# EAGLE schematic p1-001 (EAGLE 9.6.2)
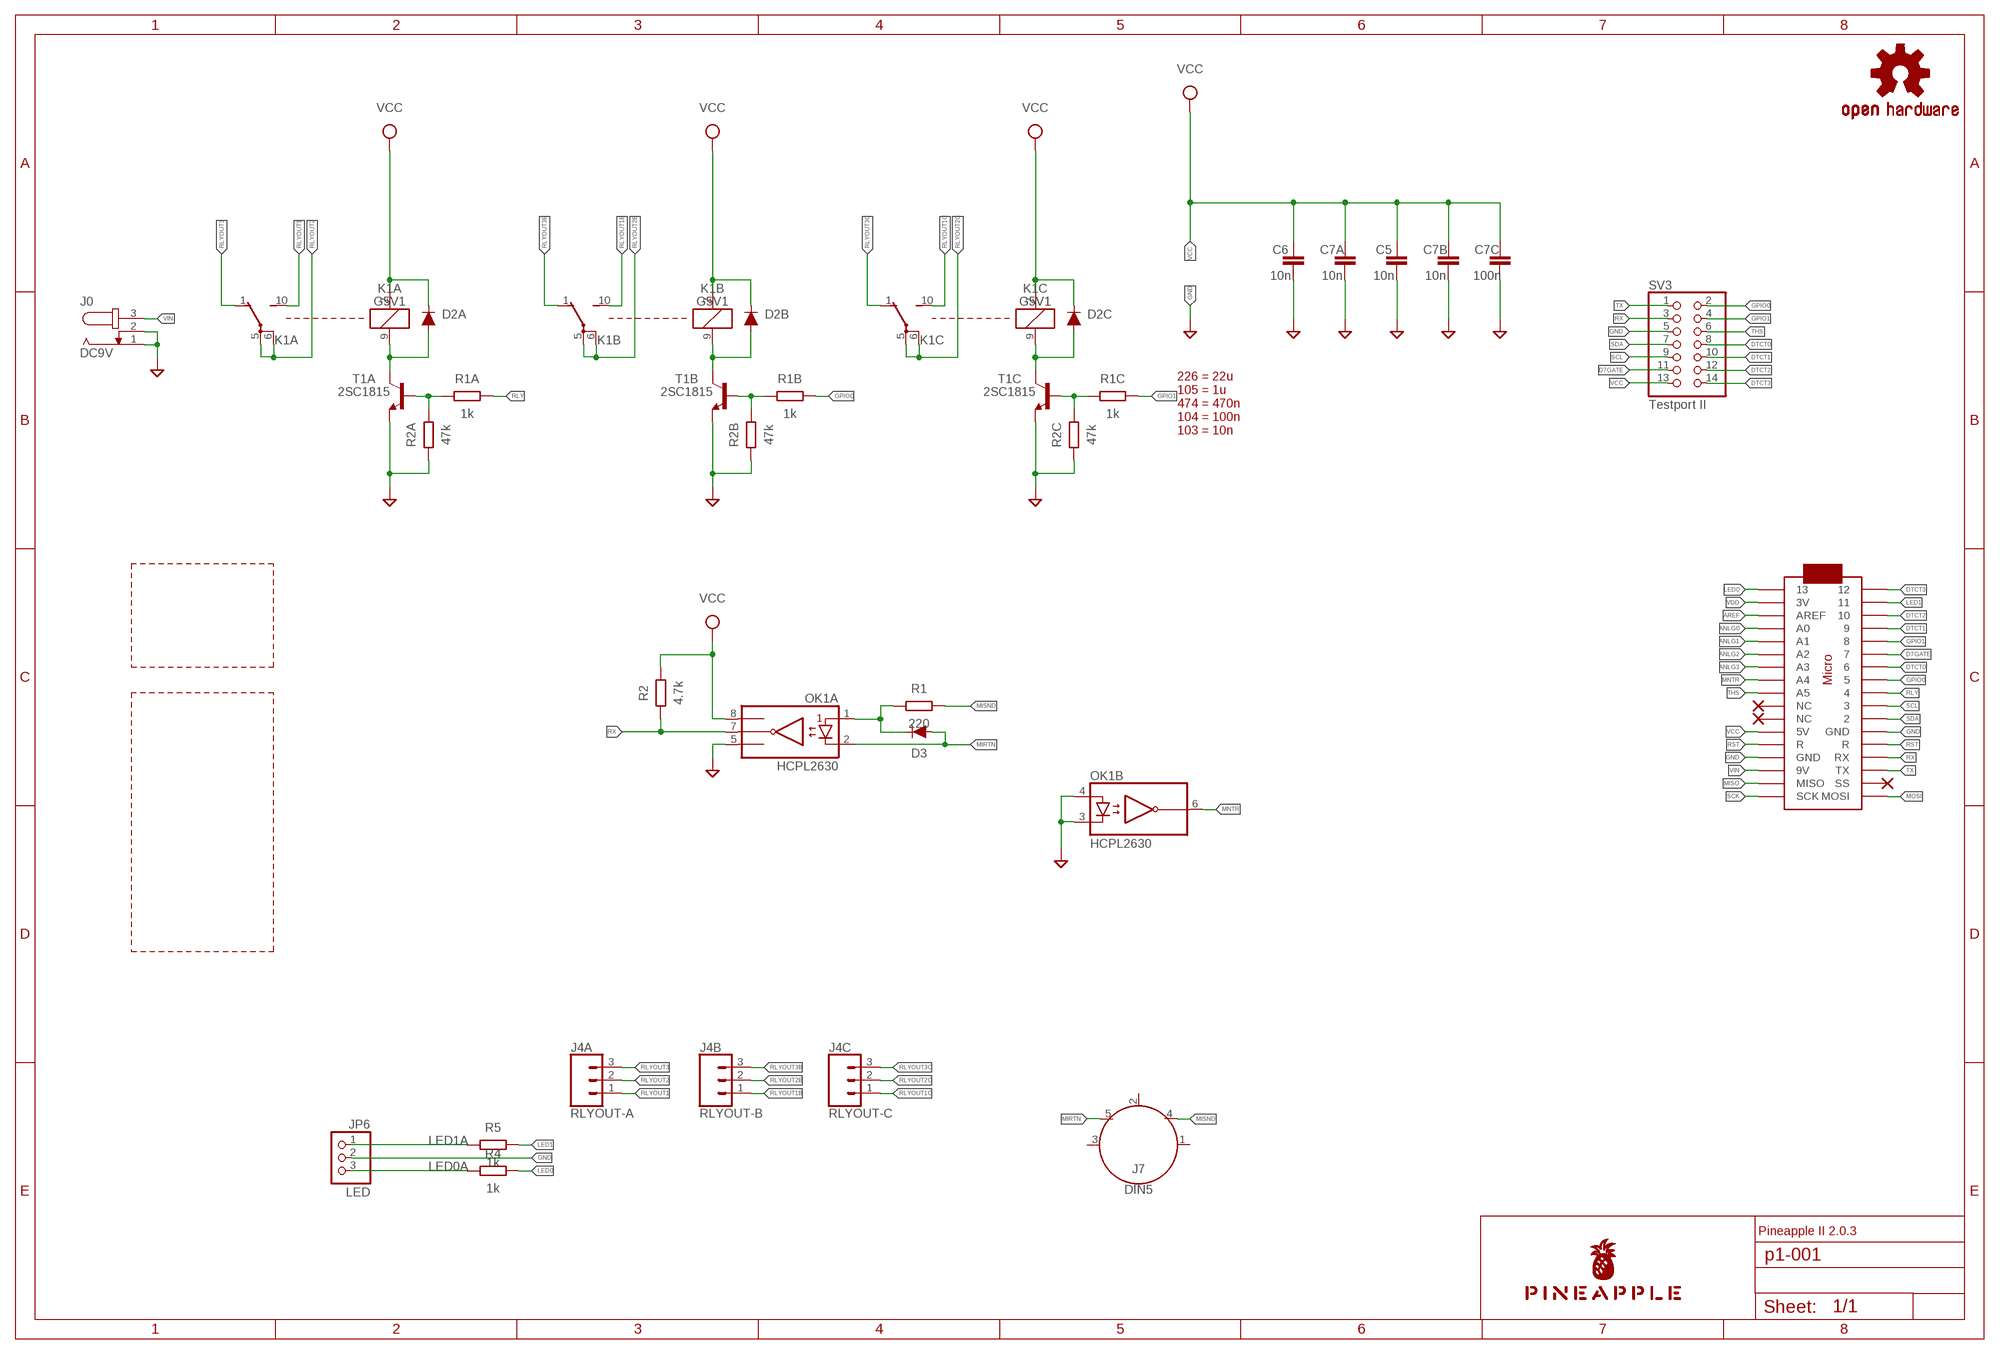
[diagram p0: schematic, sheet 1]

## Parts
C5  10n  C-EU025-024X044  [C025-024X044]
C6  10n  C-EU025-024X044  [C025-024X044]
C7A  10n  C-EU025-024X044  [C025-024X044]
C7B  10n  C-EU025-024X044  [C025-024X044]
C7C  100n  C-EU025-024X044  [C025-024X044]
D2A  DIODE-1N4148  [DIODE-1N4148]
D2B  DIODE-1N4148  [DIODE-1N4148]
D2C  DIODE-1N4148  [DIODE-1N4148]
D3  DIODE-1N4148  [DIODE-1N4148]
J0  DC9V  JACK-PLUG0  [SPC4077]
J4A  RLYOUT-A  CONN_03JST-PTH  [JST-3-PTH]
J4B  RLYOUT-B  CONN_03JST-PTH  [JST-3-PTH]
J4C  RLYOUT-C  CONN_03JST-PTH  [JST-3-PTH]
J7  DIN5  [DIN5-RA-PTH]
JP6  LED  PINHD-1X3  [1X03]
K1A  G5V1  [G5V1]
K1B  G5V1  [G5V1]
K1C  G5V1  [G5V1]
LOGO1  OSHW-LOGOS-COPPER  [OSHW-LOGO-S_COPPER]
MC1  ARDUINOMICRO  [ARDUINOMICRO]
OK1  HCPL2630  [DIL08]
R1  220  R-EU_0204/5  [0204/5]
R1A  1k  R-EU_0204/5  [0204/5]
R1B  1k  R-EU_0204/5  [0204/5]
R1C  1k  R-EU_0204/5  [0204/5]
R2  4.7k  R-EU_0204/5  [0204/5]
R2A  47k  R-EU_0204/5  [0204/5]
R2B  47k  R-EU_0204/5  [0204/5]
R2C  47k  R-EU_0204/5  [0204/5]
R4  1k  R-EU_0204/5  [0204/5]
R5  1k  R-EU_0204/5  [0204/5]
SV3  Testport II  PINHD-2X7  [2X07]
T1A  2SC1815  [TO92-ECB]
T1B  2SC1815  [TO92-ECB]
T1C  2SC1815  [TO92-ECB]
U$1  PINEAPPLE450_SILK  [PINEAPPLE450_SILK]

## Nets
ANLG0 [analog]: MC1.P$31(A0)
ANLG1 [analog]: MC1.P$30(A1)
ANLG2 [analog]: MC1.P$29(A2)
ANLG3 [analog]: MC1.P$28(A3)
AREF: MC1.P$32(AREF)
D7GATE: MC1.P$6 SV3.11
DTCT0: MC1.P$7 SV3.8
DTCT1: MC1.P$4 SV3.10
DTCT2: MC1.P$3 SV3.12
DTCT3: MC1.P$1 SV3.14
GND [gnd]: C5.2 C6.2 C7A.2 C7B.2 C7C.2 J0.1 J0.2 JP6.2 MC1.P$12(GND) MC1.P$21(GND) OK1.3(B:C2) OK1.4(B:A2) OK1.5(A:GND) R2A.1 R2B.1 R2C.1 SV3.5 T1A.E T1B.E T1C.E
GPIO0: MC1.P$8 R1B.2 SV3.2
GPIO1: MC1.P$5 R1C.2 SV3.4
LED0: MC1.P$34 R4.2
LED0A: JP6.3 R4.1
LED1: MC1.P$2 R5.2
LED1A: JP6.1 R5.1
MIDIINSND: D3.C OK1.1(A:A1) R1.1
MIRTN: D3.A J7.5 OK1.2(A:C1)
MISND: J7.4 R1.2
MISO: MC1.P$19(MISO)
MNTR: MC1.P$27(A4) OK1.6(B:VO2)
MOSI: MC1.P$17(MOSI)
RLY: MC1.P$9 R1A.2
RLYDRV: R1A.1 R2A.2 T1A.B
RLYDRV1: R1B.1 R2B.2 T1B.B
RLYDRV2: R1C.1 R2C.2 T1C.B
RLYOUT1: J4A.1 K1A.10(2:S)
RLYOUT1B: J4B.1 K1B.10(2:S)
RLYOUT1C: J4C.1 K1C.10(2:S)
RLYOUT2: J4A.2 K1A.5(2:P) K1A.6(2:P)
RLYOUT2B: J4B.2 K1B.5(2:P) K1B.6(2:P)
RLYOUT2C: J4C.2 K1C.5(2:P) K1C.6(2:P)
RLYOUT3: J4A.3 K1A.1(2:O)
RLYOUT3B: J4B.3 K1B.1(2:O)
RLYOUT3C: J4C.3 K1C.1(2:O)
RLYSNK: D2A.A K1A.9 T1A.C
RLYSNK1: D2B.A K1B.9 T1B.C
RLYSNK2: D2C.A K1C.9 T1C.C
RST: MC1.P$13(R) MC1.P$22(R)
RX: MC1.P$14(RX) OK1.7(A:VO1) R2.1 SV3.3
SCK: MC1.P$18(SCK)
SCL: MC1.P$10 SV3.9
SDA: MC1.P$11 SV3.7
THS: MC1.P$26(A5) SV3.6
TX: MC1.P$15(TX) SV3.1
VCC [power]: C5.1 C6.1 C7A.1 C7B.1 C7C.1 D2A.C D2B.C D2C.C K1A.2 K1B.2 K1C.2 MC1.P$23(5V) OK1.8(A:VCC) R2.2 SV3.13
VDD [power]: MC1.P$33(3V)
VIN [superpower]: J0.3 MC1.P$20(9V)
Unconnected: J7.1 J7.2 J7.3 MC1.P$16(SS) MC1.P$24(NC) MC1.P$25(NC)

## Notes on the sheet
- 226 = 22u
  105 = 1u
  474 = 470n
  104 = 100n
  103 = 10n
- Pineapple II 2.0.3

## Library data of the parts
C5 C6 C7A C7B C7C = resistor:C-EU: CAPACITOR, European symbol
D2A D2B D2C D3 = SparkFun-DiscreteSemi:DIODE: Diode These are standard reverse protection diodes and small signal diodes. SparkFun Products: SparkFun SparkPunk Sound Kit <https://www.sparkfun.com/products/11177> SparkFun ESP8266 Thing <https://www.sparkfun.com/products/13231>; PROD_ID: DIO-08378; VALUE: 200mA/100V/1V
J0 = con-jack:JACK-PLUG: DC POWER JACK Power Jack, DC, Right Angle, Through Hole, Rated 5A at 16VDC, PC Terminals Distributor: Farnell (www.Farnell.de) Drawing: 84N1161.pdf / 84N1162.pdf Manufacturer: SPC Technology (www.spctechnology.com) Type: SPC4077 / SPC 4078; OC_FARNELL: unknown; OC_NEWARK: unknown
J4A J4B J4C = SparkFun-Connectors:CONN_03: Multi connection point. Often used as Generic Header-pin footprint for 0.1 inch spaced/style header connections On any of the 0.1 inch spaced packages, you can populate with these: Break Away Headers - Straight <https://www.sparkfun.com/products/116> (PRT-00116) Break Away Male Headers - Right Angle <https://www.sparkfun.com/products/553> (PRT-00553) Female Headers <https://www.sparkfun.com/products/115> (PRT-00115) Break Away Headers - Machine Pin <https://www.sparkfun.com/products/117> (PRT-00117) Break Away Female Headers - Swiss Machine Pin <https://www.sparkfun.com/products/743> (PRT-00743) Stackable Header - 3 Pin (Female, 0.1") <https://www.sparkfun.com/products/13875> (PRT-13875) For SCREWTERMINALS and SPRING TERMINALS visit here: Screw Terimnals on SparkFun.com <https://www.sparkfun.com/search/results?term=Screw+Terminals> (5mm/3.5mm/2.54mm spacing) This device is also useful as a general connection point to wire up your design to another part of your project. Our various solder wires solder well into these plated through hole pads. Hook-Up Wire - Assortment (Stranded, 22 AWG) <https://www.sparkfun.com/products/11375> (PRT-11375) Hook-Up Wire - Assortment (Solid Core, 22 AWG) <https://www.sparkfun.com/products/11367> (PRT-11367) View the entire wire category on our website here <https://www.sparkfun.com/categories/141> Special notes: Molex polarized connector foot print use with SKU : PRT-08232 with associated crimp pins and housings.; PROD_ID: WIRE-10037; SF_ID: PRT-09915
J7 = SparkFun-Connectors:DIN5: DIN5 Connector - Female Right Angle (frequently used as a MIDI Jack connector) This type of connector and cable is frequently used for transmitting midi data (musical instrument digital interface). It is what you usually see on a keyboard or set of electronic drums. Learn more here <https://en.wikipedia.org/wiki/MIDI>. For more information on the pinout and electrical specifications of MIDI communications, please see the following resource: https://www.midi.org/specifications/item/midi-din-electrical-specification Here is the connector we sell at SparkFun: MIDI Connector - Female Right Angle <https://www.sparkfun.com/products/9536> (PRT-09536) Datasheet <hhttp://www.sparkfun.com/datasheets/Prototyping/Connectors/MIDI-RA.pdf> It is used on this SparkFun product: SparkFun MIDI Shield <https://www.sparkfun.com/products/12898> (DEV-12898); PROD_ID: CONN-09481
JP6 = pinhead:PINHD-1X3: PIN HEADER
K1A K1B K1C = relay:G5V1: RELAY 1 x switch, 0.5 A/125 V AC, 1 A/24 V DC , Omron; MPN: G5V-1-DC24; OC_FARNELL: 9949593; OC_NEWARK: 36M6377
LOGO1 = SparkFun-Aesthetics:OSHW-LOGO: Open-Source Hardware (OSHW) Logo This logo indicates the piece of hardware it is found on incorporates a OSHW license and/or adheres to the definition of open source hardware found here: http://freedomdefined.org/OSHW
MC1 = adafruit:ARDUINOMICRO
OK1 = optocoupler:HCPL2630: HEWLETT PACKARD OPTO COUPLER; MF: AGILENT TECHNOLOGIES; MPN: HCPL-2630-000E; OC_FARNELL: 9994904; OC_NEWARK: 88H7813
R1 R1A R1B R1C R2 R2A R2B R2C R4 R5 = resistor:R-EU_: RESISTOR, European symbol
SV3 = pinhead:PINHD-2X7: PIN HEADER
T1A T1B T1C = transistor:2SC1815: NPN EPITAXIAL TRANSISTOR Source: TOSHIBA .. 2SC1815 1.pdf
U$1 = pineapple:PINEAPPLE450_SILK

## Net classes
0 default: width 0.152 mm, drill 0.152 mm, clearance 0.152 mm
1 gnd: width 0.305 mm, drill 0.152 mm, clearance 0.152 mm
2 power: width 0.508 mm, drill 0.152 mm, clearance 0.152 mm
3 analog: width 0.305 mm, drill 0.152 mm, clearance 0.152 mm
4 superpower: width 1.016 mm, drill 0.152 mm, clearance 0.152 mm